# Altium schematic sheet Gilbert Cell Mixer.SchDoc
size A; SheetNumber: 3; SheetTotal: 4
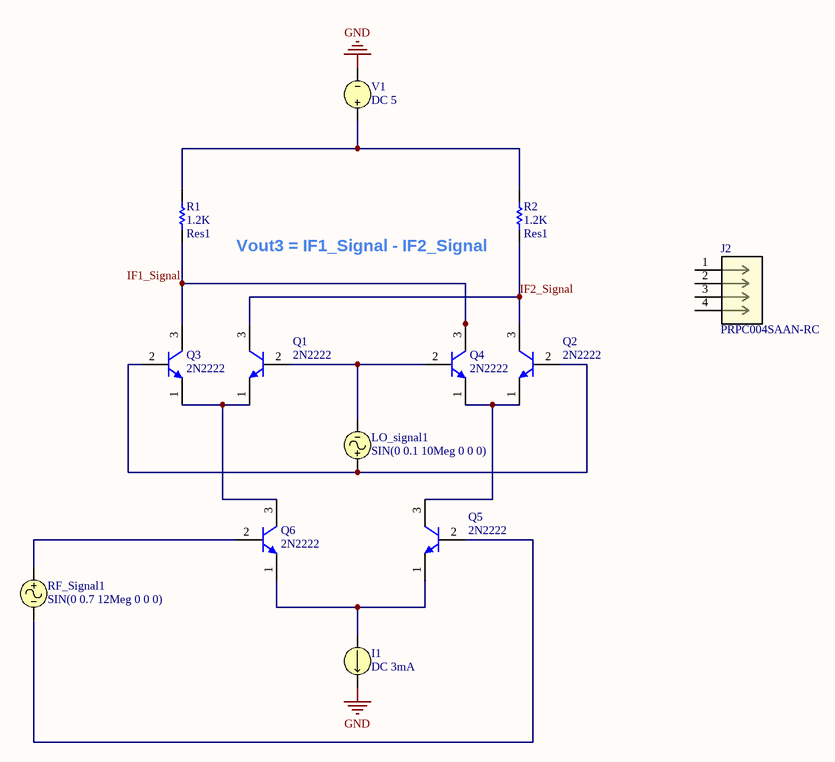
[diagram p0: Gilbert Cell Mixer.SchDoc]

## Parts
I1  DC 3mA
J2  PRPC004SAAN-RC  [CONN4_PRPC004_SUL]
LO_signal1  SIN(0 0.1 10Meg 0 0 0)
Q1  2N2222  [MLTC-TO-18-3]
Q2  2N2222  [MLTC-TO-18-3]
Q3  2N2222  [MLTC-TO-18-3]
Q4  2N2222  [MLTC-TO-18-3]
Q5  2N2222  [MLTC-TO-18-3]
Q6  2N2222  [MLTC-TO-18-3]
R1  Res1  value 1.2K  [AXIAL-0.1-RES]
R2  Res1  value 1.2K  [AXIAL-0.1-RES]
RF_Signal1  SIN(0 0.7 12Meg 0 0 0)
V1  DC 5

## Nets
GND: I1.2 V1.2
IF1_Signal: Q3.3(C) Q4.3(C) R1.1
IF2_Signal: Q1.3(C) Q2.3(C) R2.1
NetI1_1: I1.1 Q5.1(E) Q6.1(E)
NetLO_signal1_1: LO_signal1.1 Q2.2(B) Q3.2(B)
NetLO_signal1_2: LO_signal1.2 Q1.2(B) Q4.2(B)
NetQ1_1: Q1.1(E) Q3.1(E) Q6.3(C)
NetQ2_1: Q2.1(E) Q4.1(E) Q5.3(C)
NetQ5_2: Q5.2(B) RF_Signal1.2
NetQ6_2: Q6.2(B) RF_Signal1.1
NetR1_2: R1.2 R2.2 V1.1

Not connected (* = marked no-connect by the designer): J2 1 2 3 4

## Notes on the sheet
- (near R2) Vout3 = IF1_Signal - IF2_Signal

## Library data of the parts
I1 = ISRC: Current Source; Note: PCB Footprint - Not required; AC Magnitude: 0; Published: 8-Jun-2000; LatestRevisionDate: 17-Jul-2002; LatestRevisionNote: Re-released for DXP Platform.; PackageReference: Not Applicable; Publisher: Altium Limited; AC Phase: 0; Value: 3mA
J2 = PRPC004SAAN-RC: No Description Available; Mfr_Name: Sullins; Type: Headers, Male Pins; RefDes: RefDes
LO_signal1 = VSIN: Sinusoidal Voltage Source; Note: PCB Footprint - Not required; Offset: 0; Amplitude: 0.1; Published: 8-Jun-2000; LatestRevisionDate: 15-Nov-2004; LatestRevisionNote: Corrected Netlist.; PackageReference: Not Applicable; Publisher: Altium Limited; Frequency: 10Meg; Delay: 0; Damping Factor: 0; Phase: 0; DC Magnitude: 0; AC Magnitude: 0; AC Phase: 0
Q1-Q6 = CMP-2000-05237-1: Low Power Bipolar NPN Transistor, 30 V, -65 to 200 degC, 3-Pin TO-18, RoHS, Bulk; Manufacturer: Multicomp; Pin Configuration: a; No. of Pins: 3; No. of Transistors: 1; Collector Emitter Voltage Vces: 400mV; Current Ic Continuous a Max: 800mA; Power Dissipation Pd: 500mW; Collector Emitter Voltage V(br)ceo: 30V; Gain Bandwidth ft Typ: 250MHz; Voltage Vcbo: 60V; DC Current Gain hFE: 100; Full Power Rating Temperature: 25degC; Current Ic @ Vce Sat: 150mA; SVHC: NoSVHC(19-Dec-2012); Package Reference: TO-18-3; Package Description: 3-Pin Transistor Outline Package (TO-18), Dia 5.54 mm, Pitch Pitch 1.485mm; Datasheet URL: http://www.farnell.com/datasheets/1662272.pdf; Transistor Case Style: TO-18; Continuous Collector Current Ic Max: 800mA; Manufacturer URL: http://uk.farnell.com/b/multicomp; DC Collector Current: 800mA; Hfe Min: 100; Transistor Polarity: NPN; Power Dissipation Ptot Max: 500mW; Package / Case: TO-18; Datasheet Version: Rev. 1.1, 05/2012; Gain Bandwidth ft Min: 250MHz; Current Ic hFE: 150mA
R1 R2 = RES 1.2K OHM 5% 1/4W AXIAL: Resistor; Manufacturer Part Number: CFR-25JB-52-1K2; Designator: R?; Power Rating: 1/4W; Tolerance: 0.05; Published: 8-Jun-2000; LatestRevisionDate: 17-Jul-2002; LatestRevisionNote: Re-released for DXP Platform.; Publisher: Altium Limited
RF_Signal1 = VSIN: Sinusoidal Voltage Source; Note: PCB Footprint - Not required; Offset: 0; Amplitude: 0.7; Published: 8-Jun-2000; LatestRevisionDate: 15-Nov-2004; LatestRevisionNote: Corrected Netlist.; PackageReference: Not Applicable; Publisher: Altium Limited; Frequency: 12Meg; Delay: 0; Damping Factor: 0; Phase: 0; DC Magnitude: 0; AC Magnitude: 0; AC Phase: 0
V1 = VSRC: Voltage Source; Note: PCB Footprint - Not required; AC Magnitude: 0; Value: 5; Published: 8-Jun-2000; LatestRevisionDate: 17-Jul-2002; LatestRevisionNote: Re-released for DXP Platform.; PackageReference: Not Applicable; Publisher: Altium Limited; AC Phase: 0